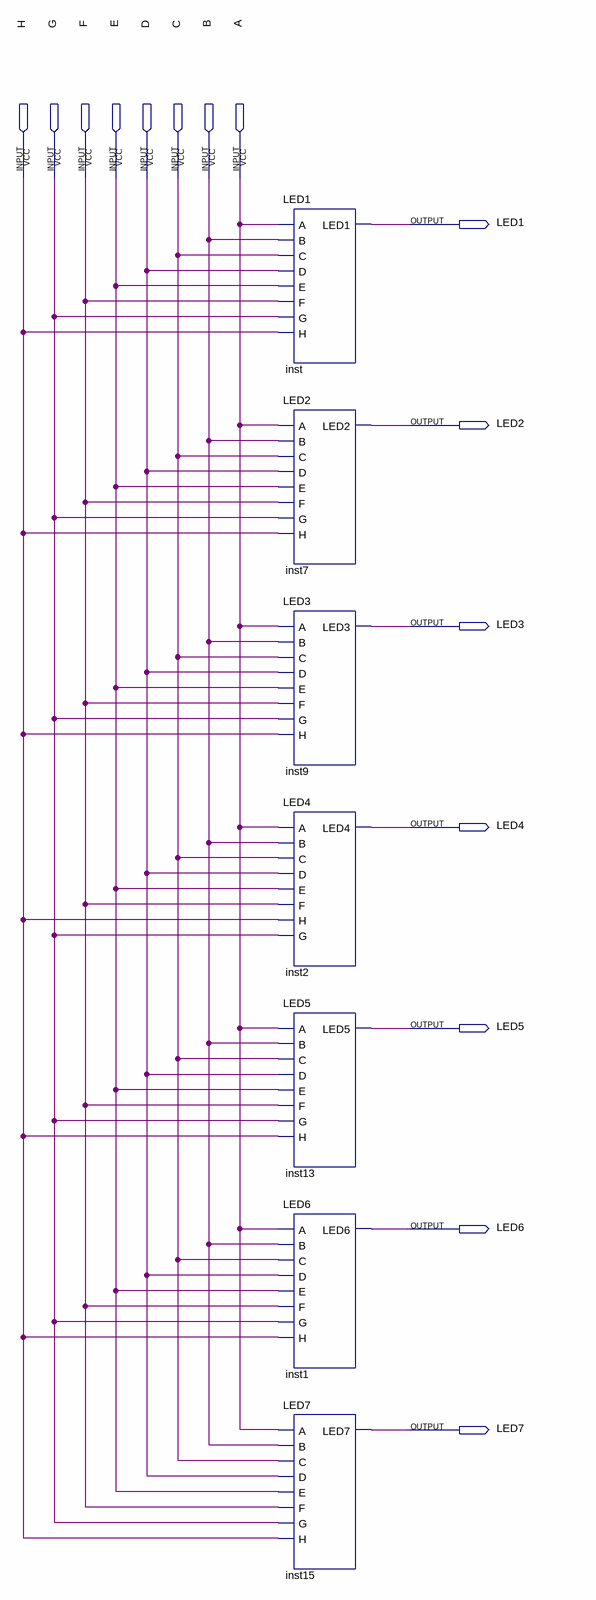
[diagram p0: schematic sheet]
// Quartus schematic InterpretadorScancode.bdf as structural Verilog: 7 symbols, 15 pins
module InterpretadorScancode (
  input  H,
  input  G,
  input  F,
  input  E,
  input  D,
  input  C,
  input  B,
  input  A,
  output LED1,
  output LED2,
  output LED3,
  output LED4,
  output LED5,
  output LED6,
  output LED7
);

  LED1 inst (.A(A), .B(B), .C(C), .D(D), .E(E), .F(F), .G(G), .H(H), .LED1(LED1));
  LED2 inst7 (.A(A), .B(B), .C(C), .D(D), .E(E), .F(F), .G(G), .H(H), .LED2(LED2));
  LED3 inst9 (.A(A), .B(B), .C(C), .D(D), .E(E), .F(F), .G(G), .H(H), .LED3(LED3));
  LED4 inst2 (.A(A), .B(B), .C(C), .D(D), .E(E), .F(F), .H(H), .G(G), .LED4(LED4));
  LED5 inst13 (.A(A), .B(B), .C(C), .D(D), .E(E), .F(F), .G(G), .H(H), .LED5(LED5));
  LED6 inst1 (.A(A), .B(B), .C(C), .D(D), .E(E), .F(F), .G(G), .H(H), .LED6(LED6));
  LED7 inst15 (.A(A), .B(B), .C(C), .D(D), .E(E), .F(F), .G(G), .H(H), .LED7(LED7));
endmodule
